# Altium schematic sheet DriverDC.SchDoc
size A3
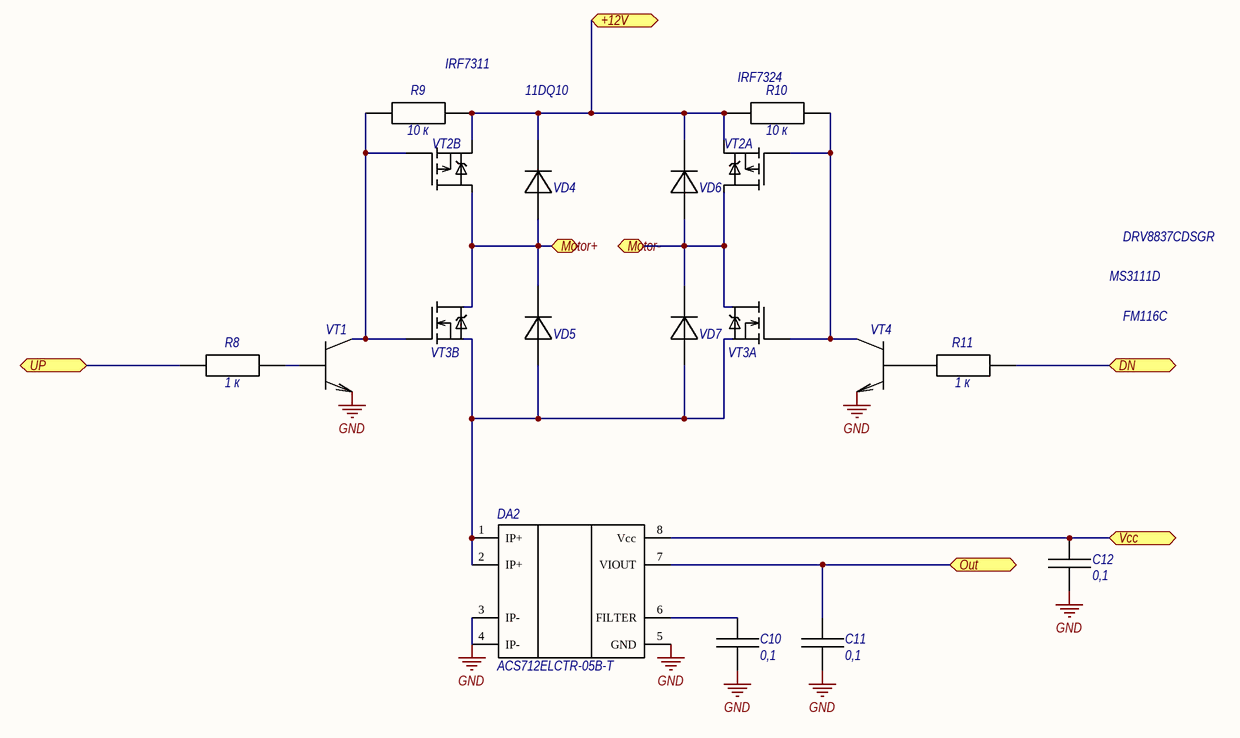
[diagram p0: DriverDC.SchDoc]

## Parts
C10  Value Sch: 0,1  [C0603_autoMount]  (hidden comment: Конденсаторы керамические)
C11  Value Sch: 0,1  [C0603_autoMount]  (hidden comment: Конденсаторы керамические)
C12  Value Sch: 0,1  [C0603_autoMount]  (hidden comment: Конденсаторы керамические)
DA2  ManufacturerPartNumber: ACS712ELCTR-05B-T  [SOIC-8]  (hidden comment: ASC712)
R8  Value Sсh: 1 к  [R0603_autoMount]  (hidden comment: Resistor)
R9  Value Sсh: 10 к  [R0603_autoMount]  (hidden comment: Resistor)
R10  Value Sсh: 10 к  [R0603_autoMount]  (hidden comment: Resistor)
R11  Value Sсh: 1 к  [R0603_autoMount]  (hidden comment: Resistor)
VD4  Diode  [DO-41_H_10mm]  (value not drawn)
VD5  Diode  [DO-41_H_10mm]  (value not drawn)
VD6  Diode  [DO-41_H_10mm]  (value not drawn)
VD7  Diode  [DO-41_H_10mm]  (value not drawn)
VT1  npn  [SOT23-3]  (value not drawn)
VT2  2P-Chanel Mosfet_SO_8  [SO-8]  (value not drawn)  (parts A,B of 2)
VT3  2N-Chanel Mosfet_SO_8  [SO-8]  (value not drawn)  (parts A,B of 2)
VT4  npn  [SOT23-3]  (value not drawn)

## Ports
+12V, DN, Motor+, Motor-, Out, UP, Vcc

## Nets
GND: C10.1 C11.1 C12.1 DA2.3(IP-) DA2.4(IP-) DA2.5(GND) VT1.2(E) VT4.2(E)
+12V: R9.1 R10.2 VD4.1 VD6.1 VT2.1(S2) VT2.3(S1) ; port +12V
DN: R11.1 ; port DN
Motor+: VD4.2 VD5.1 VT2.7,8(D2) VT3.5,6(D2) ; port Motor+
Motor-: VD6.2 VD7.1 VT2.5,6(D1) VT3.7,8(D1) ; port Motor-
Out: C11.2 DA2.7(VIOUT) ; port Out
UP: R8.2 ; port UP
Vcc: C12.2 DA2.8(Vcc) ; port Vcc
NetC10_2: C10.2 DA2.6(FILTER)
NetDA2_1: DA2.1(IP+) DA2.2(IP+) VD5.2 VD7.2 VT3.1(S1) VT3.3(S2)
NetR8_1: R8.1 VT1.1(B)
NetR9_2: R9.2 VT1.3(C) VT2.2(G2) VT3.4(G2)
NetR10_1: R10.1 VT2.4(G1) VT3.2(G1) VT4.3(C)
NetR11_2: R11.2 VT4.1(B)

## Notes on the sheet
- (near R9) IRF7311
- 11DQ10
- (near R10) IRF7324
- DRV8837CDSGR
- MS3111D
- FM116C

## Library data of the parts
C10-C12 = Чип. керам. 0603 0,1 мкФ 50 В +/-10% X7R CC0603KKX7R9BB104 "Yageo": Part Number Euro: 100 nF 50  V +/-10% X7R CC0603KKX7R9BB104 "Yageo"; Power/Voltage: 50 В; Voltage Euro: 50  V; TKE: X7R; Tolerance: +/-10%; Value: 0,1 мкФ; Value Euro: 100 nF; Part Number: Чип. керам. 0603 0,1 мкФ 50 В +/-10% X7R CC0603KKX7R9BB104 "Yageo"; Manufacturer: "Yageo"; ManufacturerPartNumber: CC0603KKX7R9BB104; Package: Чип конд. 0603; Price: 9; ComponentType: Чип. керам. 0603
DA2 = Микросхема ACS712ELCTR-05B-T "Allegro" SOIC-8: Part Number: Микросхема ACS712ELCTR-05B-T "Allegro" SOIC-8; Part Number Euro: ACS712ELCTR-05B-T "Allegro" SOIC-8; Manufacturer: "Allegro"; Package: SOIC-8; ComponentType: Микросхема
R8 R11 = Чип рез. 0603 1 кОм  +/-1% RC0603FR-071KL "Yageo": Part Number Euro: RC0603FR-071KL 1 K +/-1% "Yageo"; Tolerance: +/-1%; Value: 1 кОм; Value Euro: 1 K; Part Number: Чип рез. 0603 1 кОм  +/-1% RC0603FR-071KL "Yageo"; Manufacturer: "Yageo"; ManufacturerPartNumber: RC0603FR-071KL; Package: Чип рез. 0603; ComponentType: Чип рез. 0603
R9 R10 = Чип рез. 0603 10 кОм  +/-1% RC0603FR-0710KL "Yageo": Part Number Euro: RC0603FR-0710KL 10 K +/-1% "Yageo"; Tolerance: +/-1%; Value: 10 кОм; Value Euro: 10 K; Part Number: Чип рез. 0603 10 кОм  +/-1% RC0603FR-0710KL "Yageo"; Manufacturer: "Yageo"; ManufacturerPartNumber: RC0603FR-0710KL; Package: Чип рез. 0603; ComponentType: Чип рез. 0603
VD4-VD7 = Диод UF4007 "ST Microelectronics" DO-41: ManufacturerPartNumber: UF4007; Part Number: Диод UF4007 "ST Microelectronics" DO-41; Part Number Euro: UF4007 "ST Microelectronics" DO-41; Manufacturer: "ST Microelectronics"; Package: DO-41; ComponentType: Диод
VT1 VT4 = Транзистор BC847B SOT23-3: ManufacturerPartNumber: BC847B; Value: BC847B; Примечание: 1F; Package: SOT23-3; Part Number: Транзистор BC847B SOT23-3; Part Number Euro: BC847B SOT23-3; ComponentType: Транзистор
VT2 = Транзистор IRF9358TRPBF SO-8 "Inferon": Part Number: Транзистор IRF9358TRPBF SO-8 "Inferon"; Part Number Euro: IRF9358TRPBF SO-8 "Inferon"; Manufacturer: "Inferon"; ManufacturerPartNumber: IRF9358TRPBF; Package: SO-8; ComponentType: Транзистор
VT3 = Транзистор AO4828 SO-8 "UMV": Manufacturer: "UMV"; ManufacturerPartNumber: AO4828; Value: AO4828; Part Number: Транзистор AO4828 SO-8 "UMV"; Part Number Euro: AO4828 SO-8 "UMV"; Package: SO-8; ComponentType: Транзистор